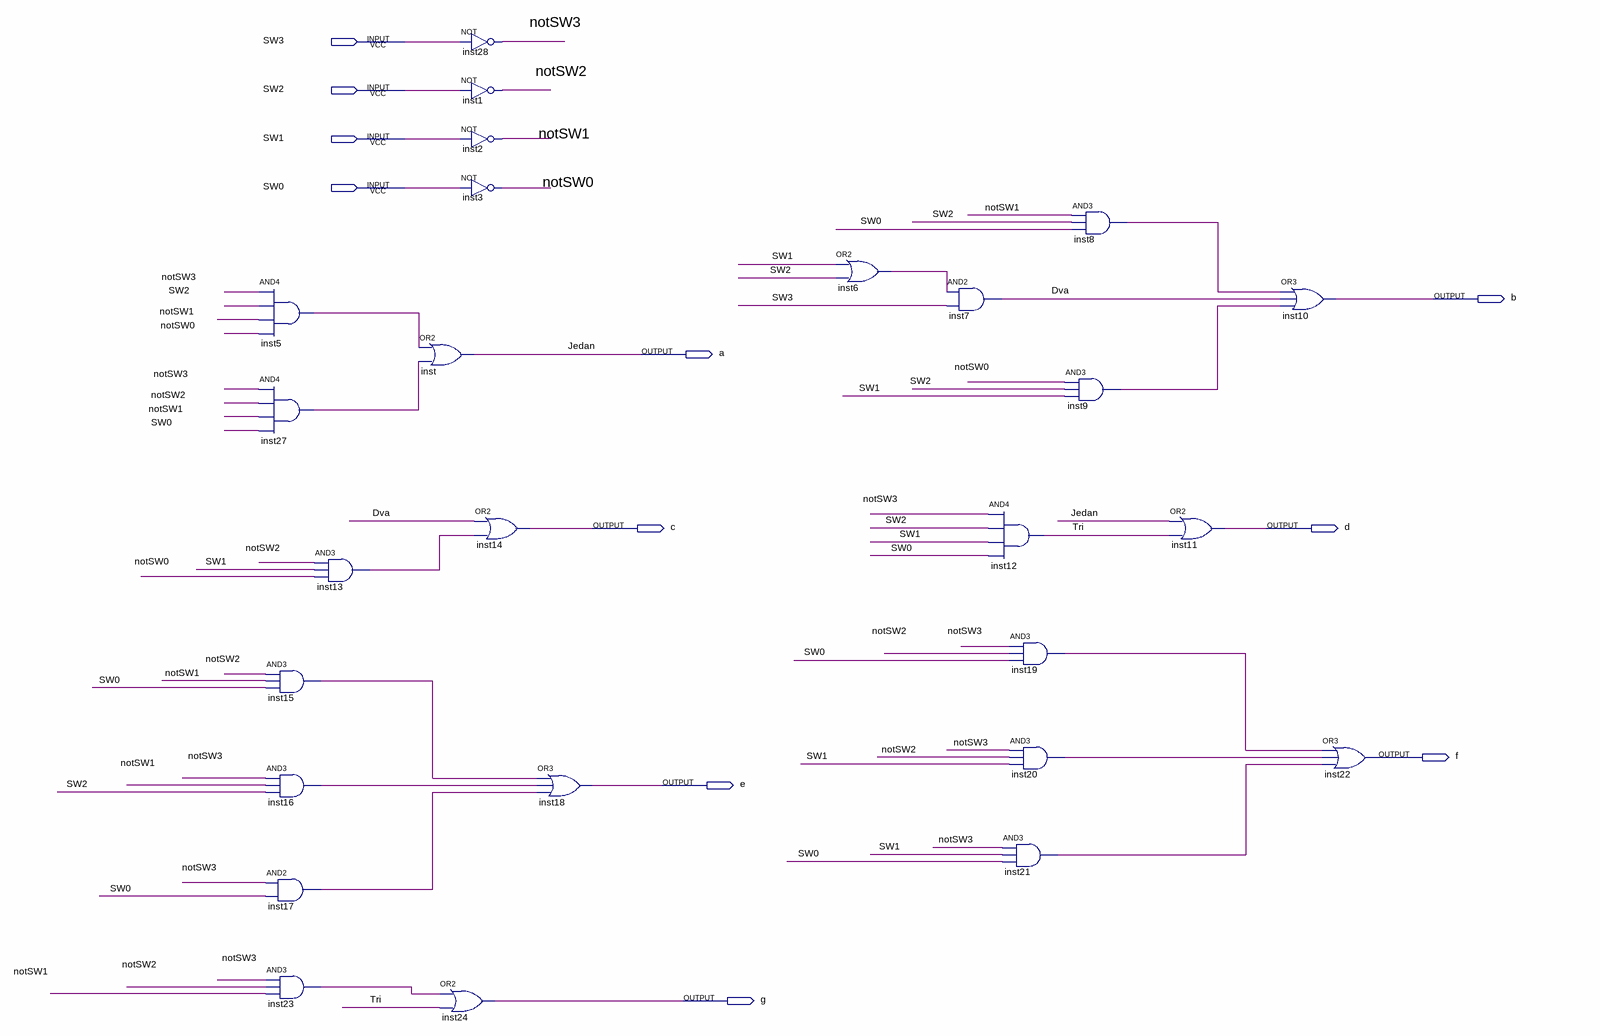
[diagram p0: schematic sheet]
// Quartus schematic PORT_Lab_1.bdf as structural Verilog: 26 symbols, 11 pins
module PORT_Lab_1 (
  input  SW3,
  input  SW2,
  input  SW1,
  input  SW0,
  output b,
  output a,
  output c,
  output d,
  output f,
  output e,
  output g
);

  wire Dva, inst5_out, inst6_out, inst8_out, inst9_out, inst13_out, inst15_out, inst16_out, inst17_out,
       inst19_out, inst20_out, inst21_out, inst23_out, inst27_out, notSW0, notSW1, notSW2, notSW3, Tri;

  and inst5 (inst5_out, notSW3, SW2, notSW1, notSW0);
  and inst27 (inst27_out, notSW3, notSW2, notSW1, SW0);
  and inst15 (inst15_out, notSW2, notSW1, SW0);
  and inst16 (inst16_out, notSW3, notSW1, SW2);
  and inst17 (inst17_out, notSW3, SW0);
  and inst23 (inst23_out, notSW3, notSW2, notSW1);
  and inst13 (inst13_out, notSW2, SW1, notSW0);
  not inst28 (notSW3, SW3);
  not inst1 (notSW2, SW2);
  not inst2 (notSW1, SW1);
  not inst3 (notSW0, SW0);
  or inst (a, inst5_out, inst27_out);
  or inst24 (g, inst23_out, Tri);
  or inst14 (c, Dva, inst13_out);
  or inst18 (e, inst15_out, inst16_out, inst17_out);
  or inst6 (inst6_out, SW1, SW2);
  and inst7 (Dva, inst6_out, SW3);
  and inst12 (Tri, notSW3, SW2, SW1, SW0);
  and inst19 (inst19_out, notSW3, notSW2, SW0);
  and inst20 (inst20_out, notSW3, notSW2, SW1);
  and inst21 (inst21_out, notSW3, SW1, SW0);
  and inst8 (inst8_out, notSW1, SW2, SW0);
  and inst9 (inst9_out, notSW0, SW2, SW1);
  or inst11 (d, a, Tri);
  or inst10 (b, inst8_out, Dva, inst9_out);
  or inst22 (f, inst19_out, inst20_out, inst21_out);

  // Other names for the same wires on the sheet: Jedan = a
endmodule
